# EAGLE design 00B-003 (EAGLE 9.6.2)
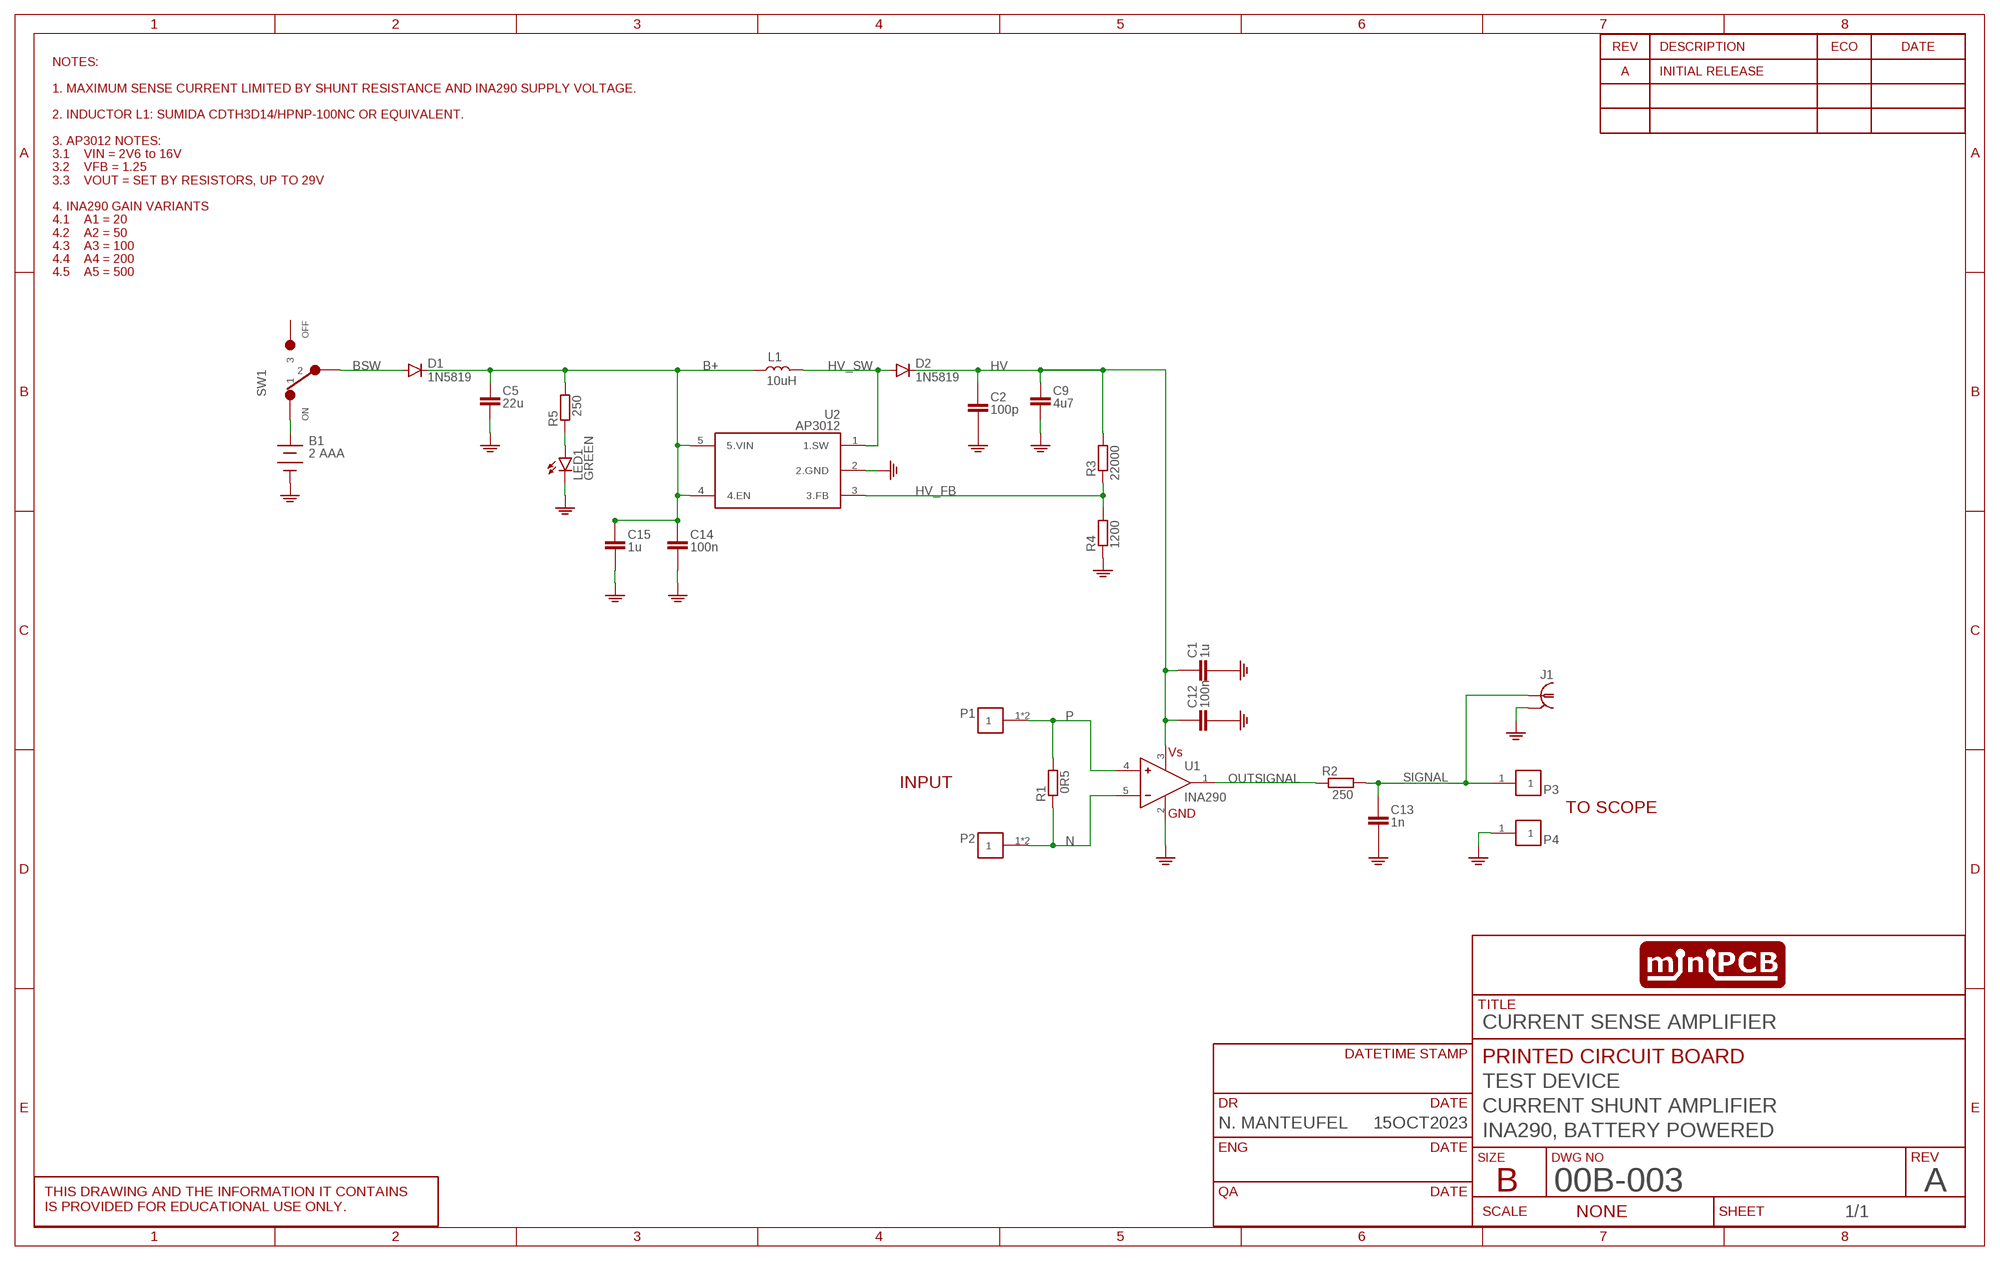
[diagram p0: schematic, sheet 1]
SHEET1 (SCHEMATIC): CIRCUIT_CATEGORY: TEST DEVICE; CIRCUIT_NAME: CURRENT SHUNT AMPLIFIER; CIRCUIT_VARIANT: INA290, BATTERY POWERED; DR: N. MANTEUFEL; DR_DATE: 15OCT2023; PCB_PCBA: PRINTED CIRCUIT BOARD; REVA: A; REVISION: A; TITLE: CURRENT SENSE AMPLIFIER

## Parts
B1  2 AAA  BATTERYAAA  [2XAAA]
C1  1u  CAPACITORSMD  [C0805]
C2  100p  CAPACITORSMD  [C0805]
C5  22u  C-EUPCR-8X10  [C-PCR-8X10]
C9  4u7  C-EUPCR-8X10  [C-PCR-8X10]
C12  100n  CAPACITORSMD  [C0805]
C13  1n  CAPACITORSMD  [C0805]
C14  100n  CAPACITORSMD  [C0805]
C15  1u  CAPACITORSMD  [C0805]
D1  1N5819  DIODESMD  [DO214AC]
D2  1N5819  DIODESMD  [DO214AC]
J1  BNC_RA  [BNC_RIGHTANGLE]
L1  10uH  L5040  [SRN5040]
LED1  GREEN  LEDCHIP-LED0805  [CHIP-LED0805]
P1  PINS_124AWG  [PINS_1_1MM]
P2  PINS_124AWG  [PINS_1_1MM]
P3  PINS_1KE_5000  [PINS_1_TESTPOINT_KE5000]
P4  PINS_1KE_5000  [PINS_1_TESTPOINT_KE5000]
R1  0R5  RESISTOR2512  [R2512K]
R2  250  RESISTORSMD  [R0805]
R3  22000  RESISTORSMD  [R0805]
R4  1200  RESISTORSMD  [R0805]
R5  250  RESISTORSMD  [R0805]
SW1  SWITCH-SPDTCK1001+TEXT  [SWITCH-C&K1001-TEXT]
U1  INA290  [SC70-5]
U2  AP3012  [SOT23-5-K]

## Nets
B+: C5.+ C14.1ASD(+) C15.1ASD(+) D1.C L1.1 R5.2 U2.4(4.EN) U2.5(5.VIN)
BSW: D1.A SW1.2
GND: B1.- C1.2ASDF(-) C2.2ASDF(-) C5.- C9.- C12.2ASDF(-) C13.2ASDF(-) C14.2ASDF(-) C15.2ASDF(-) J1.2(GND) LED1.C P4.1 R4.1 U1.2(2.GND) U2.2(2.GND)
HV: C1.1ASD(+) C2.1ASD(+) C9.+ C12.1ASD(+) D2.C R3.2 U1.3(3.VS)
HV_FB: R3.1 R4.2 U2.3(3.FB)
HV_SW: D2.A L1.2 U2.1(1.SW)
N: P2.1 P2.2 R1.1 U1.5(5.-IN)
N$1: LED1.A R5.1
N$7: B1.+ SW1.1
OUTSIGNAL: R2.1 U1.1(1.OUT)
P: P1.1 P1.2 R1.2 U1.4(4.+IN)
SIGNAL: C13.1ASD(+) J1.1 P3.1 R2.2
Unconnected: SW1.3

## Notes on the sheet
- NOTES:
  
  1. MAXIMUM SENSE CURRENT LIMITED BY SHUNT RESISTANCE AND INA290 SUPPLY VOLTAGE.
  
  2. INDUCTOR L1: SUMIDA CDTH3D14/HPNP-100NC OR EQUIVALENT.
  
  3. AP3012 NOTES:
  3.1    VIN = 2V6 to 16V
  3.2    VFB = 1.25
  3.3    VOUT = SET BY RESISTORS, UP TO 29V
  
  4. INA290 GAIN VARIANTS
  4.1    A1 = 20
  4.2    A2 = 50
  4.3    A3 = 100
  4.4    A4 = 200
  4.5    A5 = 500
- INPUT
- TO SCOPE

## Library data of the parts
B1 = nolan-utsa:BATTERY: 2xAAA battery holder for VIVA
C1 C2 C12-C15 = minipcb:CAPACITOR
C5 C9 = nolan-utsa:C-EU: CAPACITOR, European symbol
D1 D2 = minipcb:DIODE
J1 = minipcb:BNC
L1 = nolan-utsa:L
LED1 = minipcb:LED: LED OSRAM: - CHIPLED LG R971, LG N971, LY N971, LG Q971, LY Q971, LO R971, LY R971 LH N974, LH R974 LS Q976, LO Q976, LY Q976 LO Q996 - Hyper CHIPLED LW Q18S LB Q993, LB Q99A, LB R99A - SideLED LS A670, LO A670, LY A670, LG A670, LP A670 LB A673, LV A673, LT A673, LW A673 LH A674 LY A675 LS A676, LA A676, LO A676, LY A676, LW A676 LS A679, LY A679, LG A679 - Hyper Micro SIDELED® LS Y876, LA Y876, LO Y876, LY Y876 LT Y87S - SmartLED LW L88C, LW L88S LB L89C, LB L89S, LG L890 LS L89K, LO L89K, LY L89K LS L896, LA L896, LO L896, LY L896 - TOPLED LS T670, LO T670, LY T670, LG T670, LP T670 LSG T670, LSP T670, LSY T670, LOP T670, LYG T670 LG T671, LOG T671, LSG T671 LB T673, LV T673, LT T673, LW T673 LH T674 LS T676, LA T676, LO T676, LY T676, LB T676, LH T676, LSB T676, LW T676 LB T67C, LV T67C, LT T67C, LS T67K, LO T67K, LY T67K, LW E67C LS E67B, LA E67B, LO E67B, LY E67B, LB E67C, LV E67C, LT E67C LW T67C LS T679, LY T679, LG T679 LS T770, LO T770, LY T770, LG T770, LP T770 LB T773, LV T773, LT T773, LW T773 LH T774 LS E675, LA E675, LY E675, LS T675 LS T776, LA T776, LO T776, LY T776, LB T776 LHGB T686 LT T68C, LB T68C - Hyper Mini TOPLED® LB M676 - Mini TOPLED Santana® LG M470 LS M47K, LO M47K, LY M47K Source: http://www.osram.convergy.de LUXEON: - LUMILED® LXK2-PW12-R00, LXK2-PW12-S00, LXK2-PW14-U00, LXK2-PW14-V00 LXK2-PM12-R00, LXK2-PM12-S00, LXK2-PM14-U00 LXK2-PE12-Q00, LXK2-PE12-R00, LXK2-PE12-S00, LXK2-PE14-T00, LXK2-PE14-U00 LXK2-PB12-K00, LXK2-PB12-L00, LXK2-PB12-M00, LXK2-PB14-N00, LXK2-PB14-P00, LXK2-PB14-Q00 LXK2-PR12-L00, LXK2-PR12-M00, LXK2-PR14-Q00, LXK2-PR14-R00 LXK2-PD12-Q00, LXK2-PD12-R00, LXK2-PD12-S00 LXK2-PH12-R00, LXK2-PH12-S00 LXK2-PL12-P00, LXK2-PL12-Q00, LXK2-PL12-R00 Source: www.luxeon.com KINGBRIGHT: KA-3528ASYC Source: www.kingbright.com
P1-P4 = nolan-utsa:PINS_1
R1-R5 = minipcb:RESISTOR
SW1 = nolan-utsa:SWITCH-SPDT
U1 = nolan-utsa:INA290
U2 = nolan-utsa:AP3012

## Board
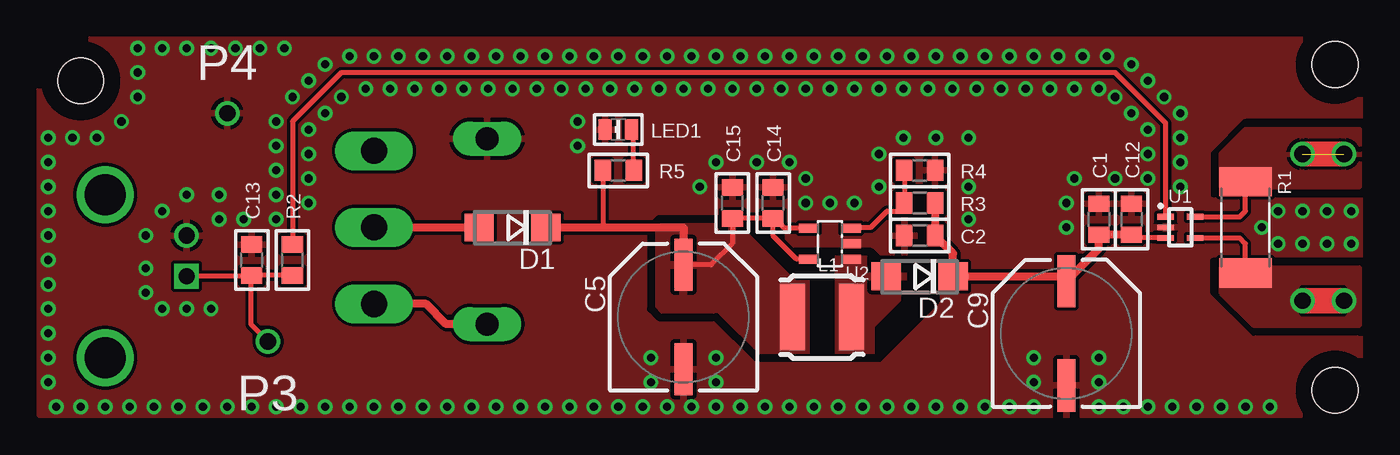
[diagram p1: board, top side]
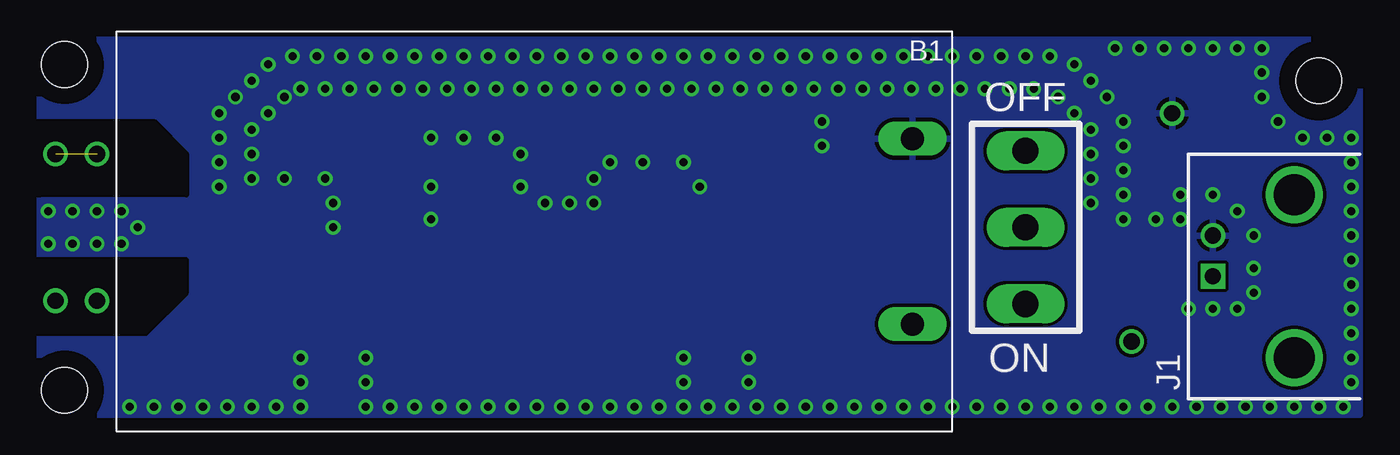
[diagram p2: board, bottom side, seen from below]

No outline drawn. Coordinates in mm, seen from the top.
Copper layers (1*16): Top 0.035mm / dielectric 1.5mm / Bottom 0.035mm
Design rules "default": minimum track width 10mil, minimum drill 24mil, track to track 8mil, track to pad 8mil, pad to pad 8mil, via to via 8mil, smd to smd 8mil, copper to edge 40mil, drill to drill 8mil, minimum pad ring 10mil, minimum via ring 8mil, stop-mask expansion 4mil, vias tented up to drill 0mil, thermal gap 10mil
Holes 2.8 mm at 3.5,21.5 80.5,22.5 80.5,2.5
tRestrict: 25 lines
bRestrict: 8 lines

### Footprints (pad centres in the part's own frame; a part is rotated, then mirrored left to right if it is on the bottom)
2XAAA = drill 1.4 long: + 2.45,6.565; - 2.45,17.945
C0805 = smd 1 x 1.3: 1ASD -0.95,0; 2ASDF 0.95,0
C-PCR-8X10 = smd 1.1 x 3.2: + 0,3.2; - 0,-3.2
DO214AC = smd 1.8 x 1.7: A 2.05,0; C -2.05,0
BNC_RIGHTANGLE = drill 1 square: 1 0,0 | drill 1: 2 -2.5,0 | drill 2.5: 3 -5,5; 4 5,5
SRN5040 = smd 1.524 x 4.064: 1 -1.803,0; 2 1.803,0
CHIP-LED0805 = smd 1.27 x 0.8: A 0,-0.8; C 0,0.8
PINS_1_1MM = drill 1: 1 0,0; 2 2.54,0
PINS_1_TESTPOINT_KE5000 = drill 1: 1 0,0
R2512K = smd 1.8 x 3.2: 1 -2.8,0; 2 2.8,0
R0805 = smd 1 x 1.3: 1 -0.95,0; 2 0.95,0
SWITCH-C&K1001-TEXT = drill 1.6 long: 1 0,4.699; 2 0,0; 3 0,-4.699
SC70-5 = smd 0.35 x 1: 1 -0.65,-0.9; 2 0,-0.9; 3 0.65,-0.9; 4 0.65,0.9; 5 -0.65,0.9
SOT23-5-K = smd 0.55 x 1.2: 1 -0.95,-1.3; 2 0,-1.3; 3 0.95,-1.3; 4 0.95,1.3; 5 -0.95,1.3

### Placement (x,y rotation side)
B1  26,0 0 top
C1  66,13 90 top
C2  55,12 180 top
C5  40.5,7 0 top
C9  64,6 0 top
C12  68,13 90 top
C13  14,10.5 90 top
C14  46,14 90 top
C15  43.5,14 90 top
D1  30,12.5 180 top
D2  55,9.5 180 top
J1  10,9.5 270 bottom
L1  49,7 0 top
LED1  36.5,18.5 90 top
P1  78.5,8 0 top
P2  78.5,17 0 top
P3  15,5.5 180 top
P4  12.5,19.5 0 top
R1  75,12.5 270 top
R2  16.5,10.5 270 top
R3  55,14 0 top
R4  55,16 180 top
R5  36.5,16 180 top
SW1  21.5,12.5 180 bottom
U1  71,12.5 270 top
U2  49.5,11.5 90 top

### Tracks (layer width: path | path; a pad name or v marks a point on that pad's centre or on a via)
B+
  Top 0.3: U2.4 46.7,12.45 46.1,13.05 C14.1ASD | C14.1ASD C15.1ASD 43.5,11.5 42.2,10.2 C5.+ | R5.2 35.55,12.55 35.5,12.5 | U2.5 47.45,10.55 46,12 C14.1ASD
  Top 0.5: D1.C 35.5,12.5 40.5,12.5 C5.+
  pour Top: 39,13 38.5,12.5 38.5,7.5 39,7 42.5,7 45,4.5 48.5,4.5 48.5,9.5 47.5,9.5 44,13
BSW
  Top 0.5: SW1.2 D1.A
GND  (via drill 0.5)
  other vias: 15.5,13 15.5,14.5 15.5,16 15.5,17.5 15.5,19 16.5,20.5 17.5,21.5 18.5,22.5 20,23 21.5,23 23,23 24.5,23 26,23 27.5,23 29,23 30.5,23 32,23 33.5,23 22.5,21 24,21 25.5,21 27,21 28.5,21 30,21 31.5,21 33,21 34.5,21 36,21 37.5,21 39,21 40.5,21 42,21 43.5,21 45,21 46.5,21 48,21 49.5,21 51,21 35,23 36.5,23 38,23 39.5,23 41,23 42.5,23 44,23 45.5,23 47,23 48.5,23 52.5,21 54,21 55.5,21 57,21 58.5,21 60,21 61.5,21 63,21 64.5,21 66,21 50,23 51.5,23 53,23 54.5,23 56,23 57.5,23 59,23 60.5,23 62,23 63.5,23 21,21 19.5,20.5 18.5,19.5 17.5,18.5 17.5,17 17.5,15.5 17.5,14 65,23 66.5,23 68,22.5 69,21.5 70,20.5 67,20.5 68,19.5 69,18.5 71,19.5 71,18 71,16.5 71,15 69,17 69,15.5 67,15.5 64.5,15.5 64,14 64,12.5 62,4.5 62,3 62,1.5 66,1.5 66,3 66,4.5 2,1.5 3.5,1.5 5,1.5 6.5,1.5 8,1.5 9.5,1.5 11,1.5 12.5,1.5 14,1.5 1.5,18 1.5,16.5 1.5,15 1.5,13.5 1.5,12 1.5,10.5 1.5,9 1.5,7.5 1.5,6 1.5,4.5 1.5,3 17,1.5 18.5,1.5 20,1.5 21.5,1.5 23,1.5 24.5,1.5 26,1.5 27.5,1.5 29,1.5 30.5,1.5 32,1.5 33.5,1.5 35,1.5 36.5,1.5 38,1.5 39.5,1.5 41,1.5 42.5,1.5 44,1.5 45.5,1.5 47,1.5 48.5,1.5 50,1.5 51.5,1.5 53,1.5 54.5,1.5 56,1.5 57.5,1.5 59,1.5 60.5,1.5 15.5,1.5 3,18 4.5,18 6,19 7,20.5 7,22 7,23.5 8.5,23.5 10,23.5 11.5,23.5 13,23.5 14.5,23.5 16,23.5 10,14.5 13.5,13 12,13 12,14.5 8.5,13.5 7.5,12 7.5,10 7.5,8.5 8.5,7.5 10,7.5 11.5,7.5 42.5,3 42.5,4.5 38.5,3 38.5,4.5 67.5,1.5 69,1.5 70.5,1.5 72,1.5 73.5,1.5 75,1.5 76.5,1.5 56,18 58,18 58,13 58,15 47,16.5 45,16.5 42.5,16.5 41.5,15 48,15.5 34,17.5 34,19 76,12.5 77,13.5 77,11.5 78.5,13.5 80,13.5 81.5,13.5 78.5,11.5 80,11.5 81.5,11.5 48,14 49.5,14 51,14 52.5,15 52.5,17 54,18
  pour Top: 1,1 1,24 82,24 82,1
  pour Bottom: 1,1 1,24 82,24 82,1
HV
  Top 0.3: U1.3 68.2,11.85 C12.1ASD
  Top 0.5: C12.1ASD C1.1ASD 66,11.2 C9.+ 63.7,9.5 D2.C 57.05,10.9 C2.1ASD R3.2
HV_FB
  Top 0.3: U2.3 50.85,12.5 52,12.5 53,13.5 54,13.5 54.05,13.55 R3.1 54,14 54.05,14.05 R4.2
HV_SW
  pour Top: 50,11 50,4.5 52,4.5 52,6.5 54,8.5 54,10.5 52.5,10.5 52,11
N  (1 unrouted)
  Top 0.3: U1.5 74.65,13.15 75,13.5 R1.1
  pour Top: 82,18.5 75,18.5 73.5,17 73.5,15 82,15
N$1
  Top 0.3: R5.1 37.45,18.35 LED1.A
N$7
  Top 0.5: B1.+ 25.93,6.57 24.7,7.8 SW1.1
OUTSIGNAL
  Top 0.3: U1.1 70.1,18.9 67,22 19.5,22 16.5,19 R2.1
P
  Top 0.3: U1.4 74.65,11.85 75,11.5 R1.2
  pour Top (no thermals): 82,10 73.5,10 73.5,8.5 75.5,6.5 82,6.5
SIGNAL
  Top 0.3: R2.2 C13.1ASD 13.97,9.53 | 13.97,9.53 13.95,9.5 J1.1 | P3.1 13.97,6.53 13.97,9.53